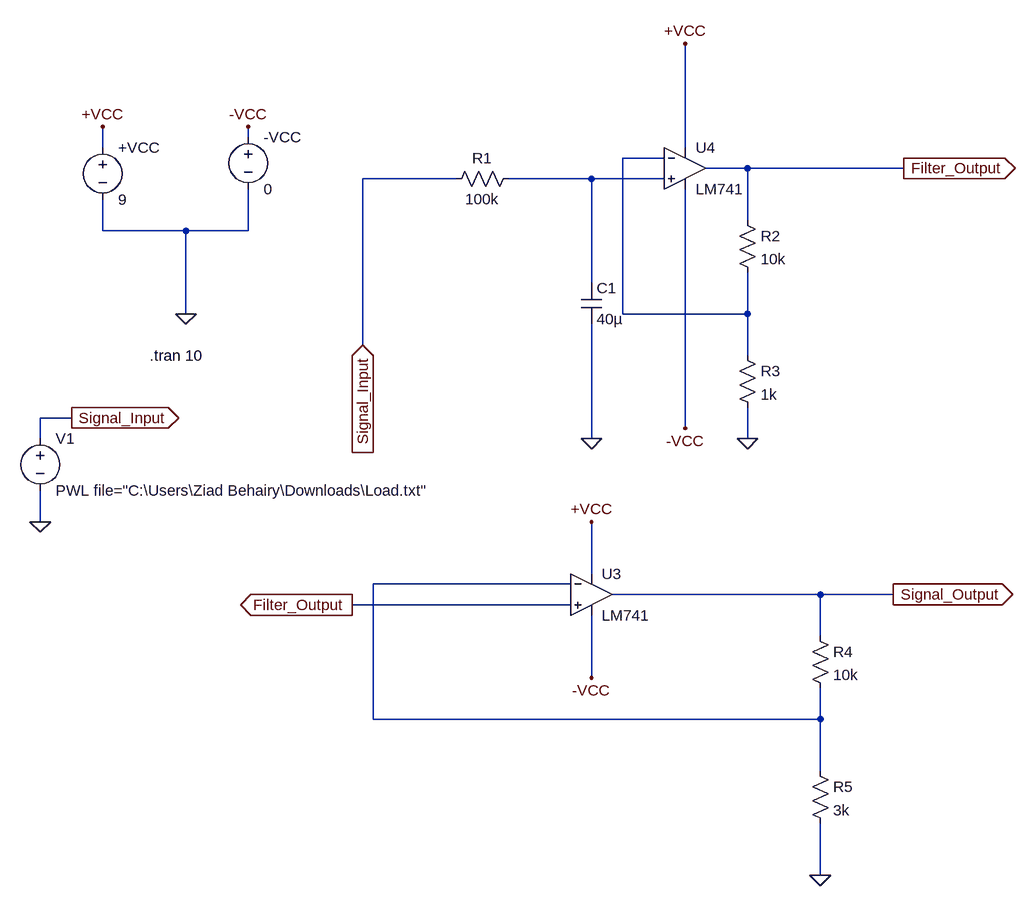
[diagram p0: schematic Final Project.asc]
Final Project.asc, the LTspice schematic file:
Version 4
SHEET 1 2072 1204
WIRE 80 48 80 32
WIRE -144 64 -144 32
WIRE 752 64 752 -96
WIRE 720 80 656 80
WIRE 848 96 784 96
WIRE 1088 96 848 96
WIRE 400 112 256 112
WIRE 608 112 480 112
WIRE 720 112 608 112
WIRE 848 176 848 96
WIRE -144 192 -144 144
WIRE -16 192 -144 192
WIRE 80 192 80 128
WIRE 80 192 -16 192
WIRE 608 272 608 112
WIRE -16 320 -16 192
WIRE 656 320 656 80
WIRE 848 320 848 256
WIRE 848 320 656 320
WIRE 256 368 256 112
WIRE 848 384 848 320
WIRE -192 480 -240 480
WIRE 752 496 752 128
WIRE -240 512 -240 480
WIRE 608 512 608 336
WIRE 848 512 848 464
WIRE -240 640 -240 592
WIRE 608 720 608 640
WIRE 576 736 272 736
WIRE 960 752 640 752
WIRE 1072 752 960 752
WIRE 576 768 240 768
WIRE 960 816 960 752
WIRE 608 880 608 784
WIRE 272 944 272 736
WIRE 960 944 960 896
WIRE 960 944 272 944
WIRE 960 1024 960 944
WIRE 960 1184 960 1104
FLAG -16 320 0
FLAG -144 32 +VCC
FLAG 80 32 -VCC
FLAG 608 512 0
FLAG -240 640 0
FLAG 848 512 0
FLAG 752 -96 +VCC
FLAG 752 496 -VCC
FLAG 608 640 +VCC
FLAG 1088 96 Filter_Output
IOPIN 1088 96 Out
FLAG 240 768 Filter_Output
IOPIN 240 768 Out
FLAG 960 1184 0
FLAG 608 880 -VCC
FLAG 1072 752 Signal_Output
IOPIN 1072 752 Out
FLAG -192 480 Signal_Input
IOPIN -192 480 Out
FLAG 256 368 Signal_Input
IOPIN 256 368 In
SYMBOL voltage -144 48 R0
WINDOW 123 0 0 Left 0
WINDOW 39 0 0 Left 0
SYMATTR InstName +VCC
SYMATTR Value 9
SYMBOL voltage 80 32 R0
WINDOW 123 0 0 Left 0
WINDOW 39 0 0 Left 0
SYMATTR InstName -VCC
SYMATTR Value 0
SYMBOL voltage -240 496 R0
WINDOW 123 0 0 Left 0
WINDOW 39 0 0 Left 0
SYMATTR InstName V1
SYMATTR Value PWL file="C:\Users\Ziad Behairy\Downloads\Load.txt"
SYMBOL res 496 96 R90
WINDOW 0 0 56 VBottom 2
WINDOW 3 32 56 VTop 2
SYMATTR InstName R1
SYMATTR Value 100k
SYMBOL cap 592 272 R0
SYMATTR InstName C1
SYMATTR Value 40µ
SYMBOL res 832 160 R0
SYMATTR InstName R2
SYMATTR Value 10k
SYMBOL res 832 368 R0
SYMATTR InstName R3
SYMATTR Value 1k
SYMBOL res 944 1008 R0
SYMATTR InstName R5
SYMATTR Value 3k
SYMBOL res 944 800 R0
SYMATTR InstName R4
SYMATTR Value 10k
SYMBOL LM741 608 688 R0
SYMATTR InstName U3
SYMBOL LM741 752 32 R0
SYMATTR InstName U4
TEXT -72 384 Left 2 !.tran 10

The netlist it stands for:
* Final Project.asc
V§+VCC +VCC 0 9
V§-VCC -VCC 0 0
V1 Signal_Input 0 PWL file="C:\Users\Ziad Behairy\Downloads\Load.txt"
R1 N002 Signal_Input 100k
C1 N002 0 40µ
R2 Filter_Output N001 10k
R3 N001 0 1k
R5 N003 0 3k
R4 Signal_Output N003 10k
XU3 Filter_Output N003 +VCC -VCC Signal_Output LM741  ; pins In+ In- V+ V- OUT
XU4 N002 N001 +VCC -VCC Filter_Output LM741  ; pins In+ In- V+ V- OUT
.tran 10
.lib LM741.lib
.backanno
.end